# EAGLE design FastLED RGB & HSV Tutorial (EAGLE 7.5.0)
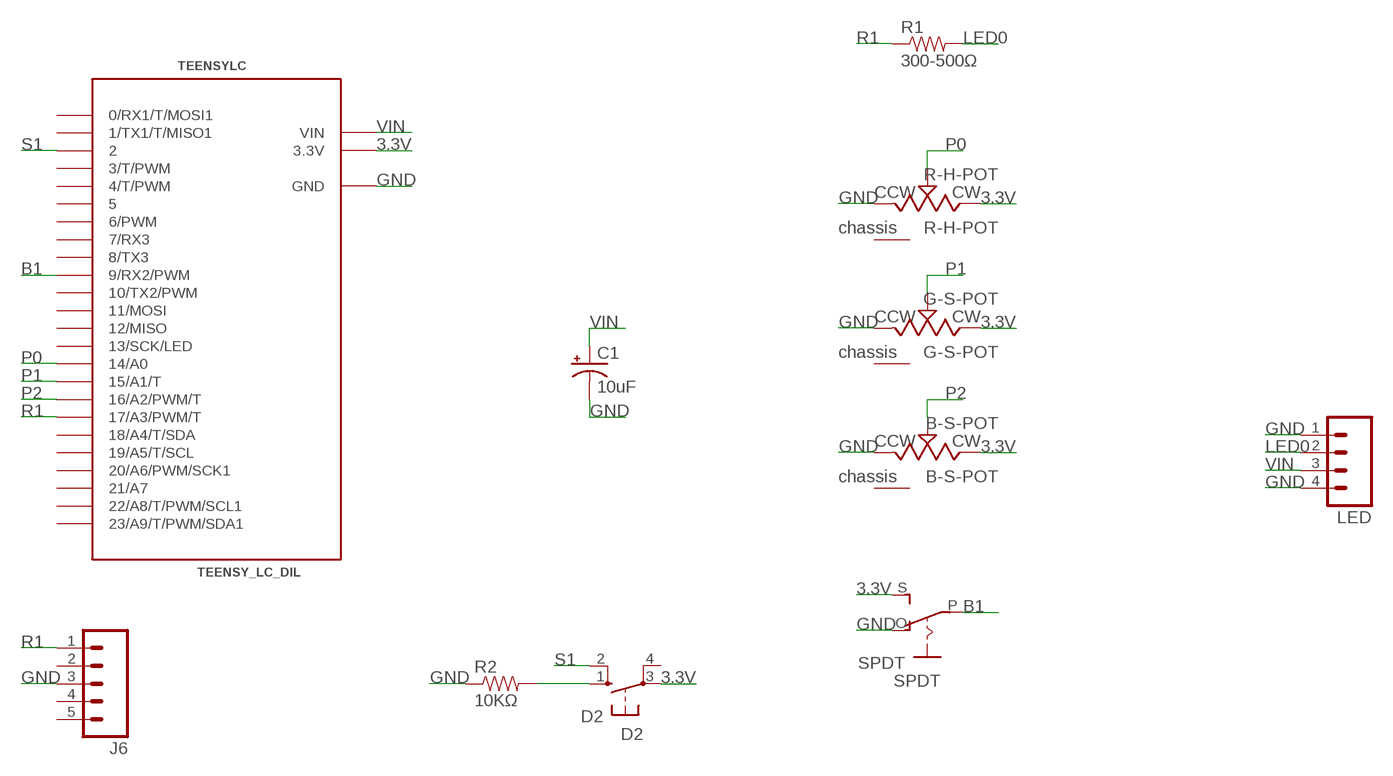
[diagram p0: schematic, sheet 1]

## Parts
B-S-POT  B-S-POT  POTENTIOMETERPTV09A_VERTICAL  [PTV09A-4]
C1  10uF  10UF-25V-20%(PTH)KIT  [CPOL-RADIAL-10UF-25V-KIT]
D2  D2  10-XX  [B3F-10XX]
G-S-POT  G-S-POT  POTENTIOMETERPTV09A_VERTICAL  [PTV09A-4]
J6  M05PTH  [1X05]
LED  M04PTH  [1X04]
R1  300-500Ω  RESISTORPTH-1/4W-VERT-KIT  [AXIAL-0.1EZ]
R2  10KΩ  RESISTORPTH-1/4W-VERT-KIT  [AXIAL-0.1EZ]
R-H-POT  R-H-POT  POTENTIOMETERPTV09A_VERTICAL  [PTV09A-4]
SPDT  SPDT  EG1218S  [EG1218]
TEENSYLC  TEENSY_LC_DIL  [TEENSY3-DIL]

## Nets
3.3V: B-S-POT.3(CW) D2.3(P) G-S-POT.3(CW) R-H-POT.3(CW) SPDT.S TEENSYLC.3.3V
B1: SPDT.P TEENSYLC.9(9/RX2/PWM)
GND: B-S-POT.1(CCW) C1.2(-) G-S-POT.1(CCW) J6.3 LED.1 LED.4 R2.P$1 R-H-POT.1(CCW) SPDT.O TEENSYLC.AGND(GND) TEENSYLC.GND
LED0: LED.2 R1.P$2
N$1: D2.1(S) R2.P$2
P0: R-H-POT.2(WIPER) TEENSYLC.14/A0
P1: G-S-POT.2(WIPER) TEENSYLC.15/A1(15/A1/T)
P2: B-S-POT.2(WIPER) TEENSYLC.16/A2(16/A2/PWM/T)
R1: J6.1 R1.P$1 TEENSYLC.17/A3(17/A3/PWM/T)
S1: D2.2(S1) TEENSYLC.2
VIN: C1.1(+) LED.3 TEENSYLC.VIN
Unconnected: B-S-POT.4(CHASSIS) D2.4(P1) G-S-POT.4(CHASSIS) J6.2 J6.4 J6.5 R-H-POT.4(CHASSIS) TEENSYLC.0(0/RX1/T/MOSI1) TEENSYLC.1(1/TX1/T/MISO1) TEENSYLC.3(3/T/PWM) TEENSYLC.4(4/T/PWM) TEENSYLC.5 TEENSYLC.6(6/PWM) TEENSYLC.7(7/RX3) TEENSYLC.8(8/TX3) TEENSYLC.10(10/TX2/PWM) TEENSYLC.11(11/MOSI) TEENSYLC.12(12/MISO) TEENSYLC.13(13/SCK/LED) TEENSYLC.18/A4(18/A4/T/SDA) TEENSYLC.19/A5(19/A5/T/SCL) TEENSYLC.20/A6(20/A6/PWM/SCK1) TEENSYLC.21/A7 TEENSYLC.22/A8(22/A8/T/PWM/SCL1) TEENSYLC.23/A9(23/A9/T/PWM/SDA1)

## Library data of the parts
B-S-POT G-S-POT R-H-POT = Bourns:POTENTIOMETER
C1 = SparkFun-Capacitors:10UF-25V-20%(PTH): CAP-08440; PROD_ID: CAP-08440
D2 = switch-omron:10-XX: OMRON SWITCH; MPN: B3F-1000; OC_FARNELL: 176432; OC_NEWARK: 36M3542
J6 = SparkFun-Connectors:M05: Header 5 Standard 5-pin 0.1" header. Use with straight break away headers (SKU : PRT-00116), right angle break away headers (PRT-00553), swiss pins (PRT-00743), machine pins (PRT-00117), and female headers (PRT-00115). Molex polarized connector foot print use with SKU : PRT-08230 with associated crimp pins and housings.
LED = SparkFun-Connectors:M04: Header 4 Standard 4-pin 0.1" header. Use with straight break away headers (SKU : PRT-00116), right angle break away headers (PRT-00553), swiss pins (PRT-00743), machine pins (PRT-00117), and female headers (PRT-00115). Molex polarized connector foot print use with SKU : PRT-08231 with associated crimp pins and housings. 1MM SMD Version SKU: PRT-10208; PROD_ID: CONN-09696
R1 R2 = SparkFun-Resistors:RESISTOR: Resistor Basic schematic elements and footprints for 0603, 1206, and PTH resistors.
SPDT = adafruit:EG1218: SLIDING SWITCH 0.1" spacing through hole, vertical SPDT slide switch http://www.ladyada.net/library/pcb/eaglelibrary.html
TEENSYLC = Teensy_3_and_LC_Series_Boards_v1.1:TEENSY_LC_DIL

## Board
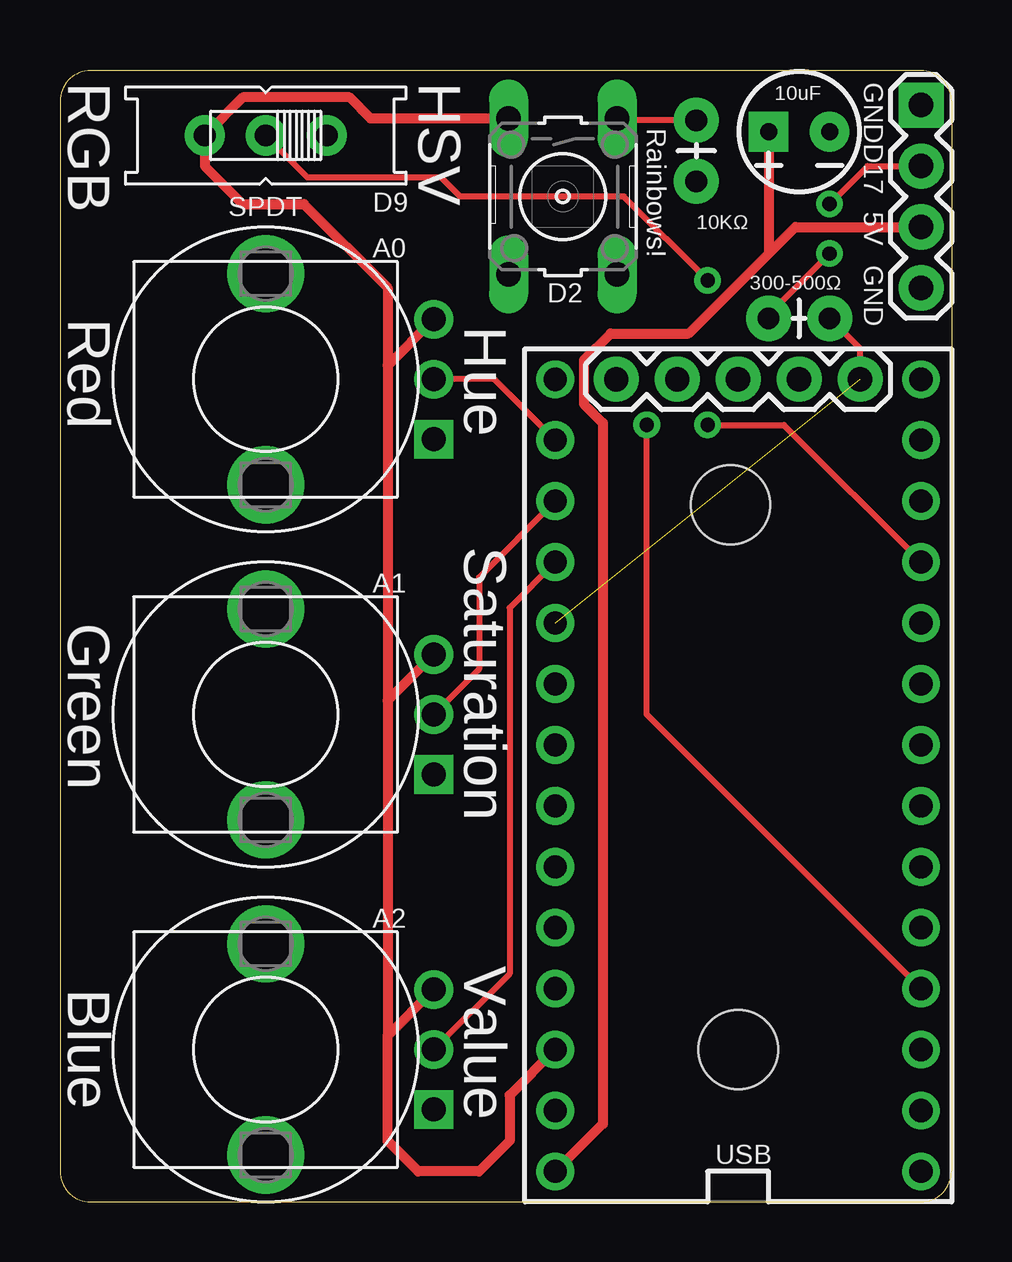
[diagram p1: board, top side]
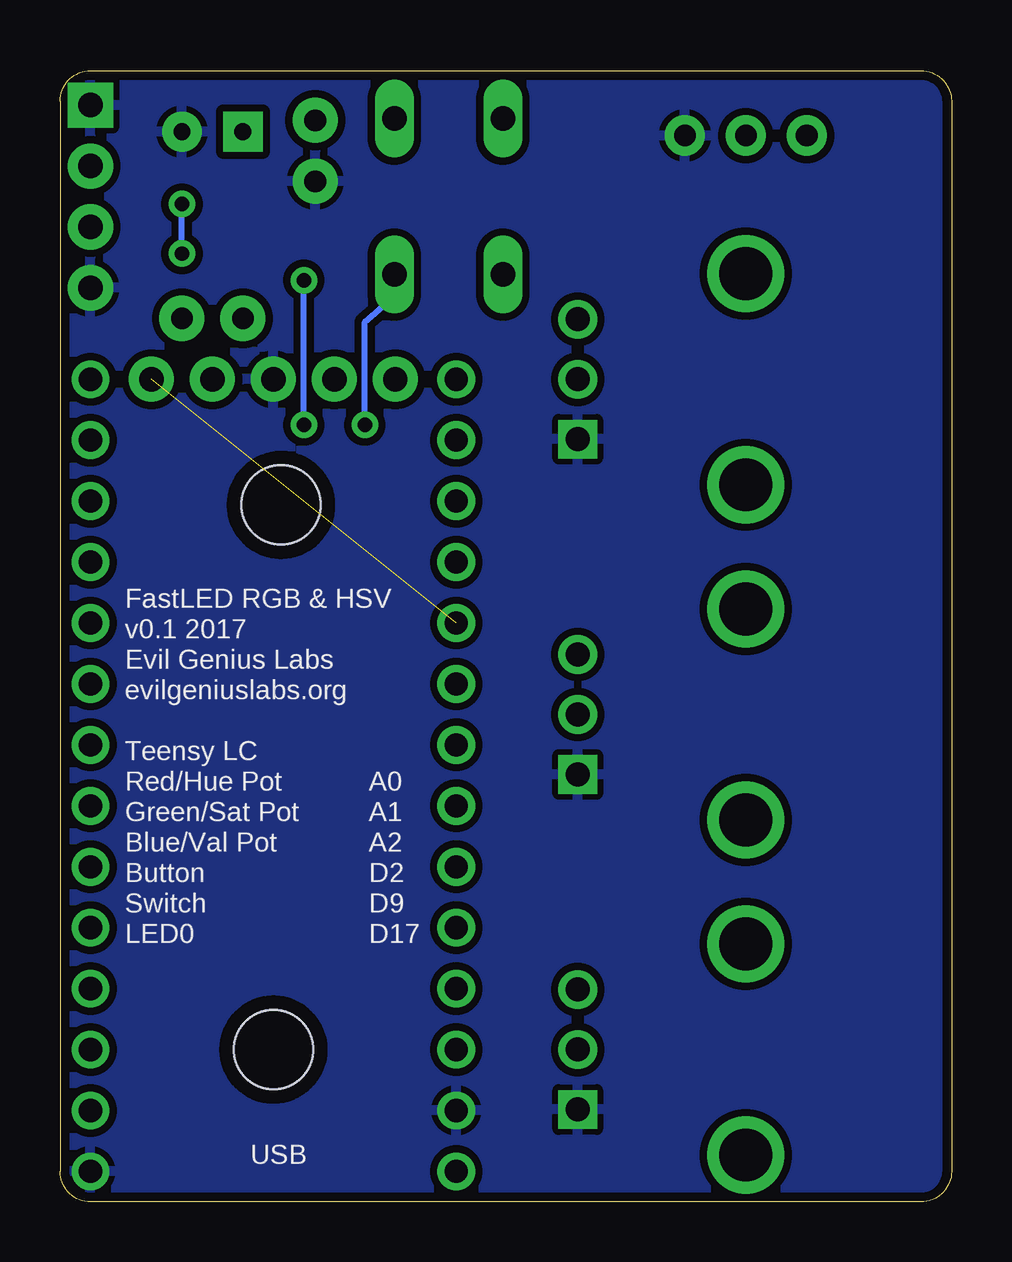
[diagram p2: board, bottom side, seen from below]

Size 37.15 x 47.15 mm. Coordinates in mm from the lower left corner, seen from the top.
Outline: 35.88,47.15 1.27,47.15 arc90 0,45.88 0,1.27 arc90 1.27,0 35.88,0 arc90 37.15,1.27 37.15,45.88 arc90 35.88,47.15
Copper layers (1*16): Top 0.0356mm / dielectric 1.5011mm / Bottom 0.0356mm
Design rules "oshpark-2layer *": minimum track width 6mil, minimum drill 13mil, track to track 6mil, track to pad 6mil, pad to pad 6mil, via to via 6mil, smd to smd 6mil, copper to edge 15mil, drill to drill 6mil, minimum pad ring 12mil, minimum via ring 10mil, stop-mask expansion 2.5mil, vias tented up to drill 25mil, thermal gap 10mil

### Footprints (pad centres in the part's own frame; a part is rotated, then mirrored left to right if it is on the bottom)
PTV09A-4 = drill 1 square: 1 -2.5,-7 | drill 1: 2 0,-7; 3 2.5,-7 | drill 2.2: 4 -4.4,0; 5 4.4,0
CPOL-RADIAL-10UF-25V-KIT = drill 0.7 pad 1.651 square: 1 1.27,0 | drill 0.7 pad 1.651: 2 -1.27,0
B3F-10XX = drill 1.016 long: 1 -3.251,2.261; 2 3.251,2.261; 3 -3.251,-2.261; 4 3.251,-2.261
1X05 = drill 1.016 pad 1.88: 1 0,0; 2 2.54,0; 3 5.08,0; 4 7.62,0; 5 10.16,0
1X04 = drill 1.016 pad 1.88 square: 1 0,0 | drill 1.016 pad 1.88: 2 2.54,0; 3 5.08,0; 4 7.62,0
AXIAL-0.1EZ = drill 0.9 pad 1.88: P$1 0,0; P$2 2.54,0
EG1218 = drill 0.9 pad 1.676: O -2.54,0; P 0,0; S 2.54,0
TEENSY3-DIL = drill 0.965: 0 -7.62,13.97; 1 -7.62,11.43; 2 -7.62,8.89; 3 -7.62,6.35; 3.3V 7.62,11.43; 4 -7.62,3.81; 5 -7.62,1.27; 6 -7.62,-1.27; 7 -7.62,-3.81; 8 -7.62,-6.35; 9 -7.62,-8.89; 10 -7.62,-11.43; 11 -7.62,-13.97; 12 -7.62,-16.51; 13 7.62,-16.51; 14/A0 7.62,-13.97; 15/A1 7.62,-11.43; 16/A2 7.62,-8.89; 17/A3 7.62,-6.35; 18/A4 7.62,-3.81; 19/A5 7.62,-1.27; 20/A6 7.62,1.27; 21/A7 7.62,3.81; 22/A8 7.62,6.35; 23/A9 7.62,8.89; AGND 7.62,13.97; GND -7.62,16.51; VIN 7.62,16.51
STAND-OFF = hole 3.302: 0,0

### Placement (x,y rotation side)
B-S-POT  8.57,6.35 90 top
C1  30.8,44.61 180 top
D2  20.96,41.91 270 top
G-S-POT  8.57,20.32 90 top
J6  33.34,34.29 180 top
LED  35.88,45.72 270 top
R1  32.07,36.83 180 top
R2  26.51,42.55 90 top
R-H-POT  8.57,34.29 90 top
SPDT  8.57,44.45 180 top
TEENSYLC  28.26,17.78 180 top
U$1  [STAND-OFF]  27.94,29.05 0 top
U$3  [STAND-OFF]  28.26,6.35 0 top

### Tracks (layer width: path | path; a pad name or v marks a point on that pad's centre or on a via)
3.3V
  Top 0.406: TEENSYLC.3.3V 18.73,4.45 18.73,2.54 17.46,1.27 14.92,1.27 13.65,2.54 13.65,6.93 | 13.65,6.93 B-S-POT.3 | G-S-POT.3 13.65,20.9 | 13.65,20.9 13.65,6.93 | R-H-POT.3 13.65,34.87 | 13.65,34.87 13.65,20.9 | 13.65,34.87 13.65,38.1 10.16,41.59 7.62,41.59 6.03,43.18 SPDT.S 7.62,46.04 12.07,46.04 12.94,45.16 D2.3
B1  (via drill 0.6)
  Top 0.254: v26.99,38.42 23.49,41.91 16.67,41.91 15.87,42.7 10.32,42.7 SPDT.P | v26.99,32.38 30.16,32.38 TEENSYLC.9
  Bottom 0.254: v26.99,32.38 v26.99,38.42
GND
  pour Bottom (isolate 0.305): 0,47.15 37.15,47.15 37.15,0 0,0
LED0  (via drill 0.6)
  Top 0.254: v32.07,41.59 33.65,43.18 LED.2 | R1.P$2 29.53,36.99 v32.07,39.53
  Bottom 0.254: v32.07,39.53 v32.07,41.59
N$1
  Top 0.254: R2.P$2 23.29,45.09 D2.1
P0
  Top 0.254: TEENSYLC.14/A0 18.1,34.29 R-H-POT.2
P1
  Top 0.254: TEENSYLC.15/A1 17.46,26.04 17.46,22.21 G-S-POT.2
P2
  Top 0.254: TEENSYLC.16/A2 18.73,24.77 18.73,9.51 B-S-POT.2
R1  (1 unrouted)
  Top 0.254: J6.1 33.34,35.56 R1.P$1
S1  (via drill 0.6)
  Top 0.254: TEENSYLC.2 24.45,20.32 v24.45,32.38
  Bottom 0.254: v24.45,32.38 24.45,36.67 23.22,37.74 D2.2
VIN
  Top 0.406: TEENSYLC.VIN 22.62,3.25 22.62,32.46 21.83,33.26 21.83,35.08 22.94,36.2 26.19,36.2 29.53,39.53 | 29.53,39.53 30.64,40.64 LED.3 | C1.1 29.53,39.53

### Text on the board
tPlace: RGB | HSV | GND | Rainbows! | D17 | D9 | 5V | A0 | GND | Red | Hue | Saturation | A1 | Green | A2 | Value | Blue | USB
bPlace: FastLED RGB & HSV | v0.1 2017 | Evil Genius Labs | evilgeniuslabs.org | Teensy LC | A0 | Red/Hue Pot | A1 | Green/Sat Pot | A2 | Blue/Val Pot | D2 | Button | D9 | Switch | D17 | LED0 | USB